# Altium project УПП.PrjPcb
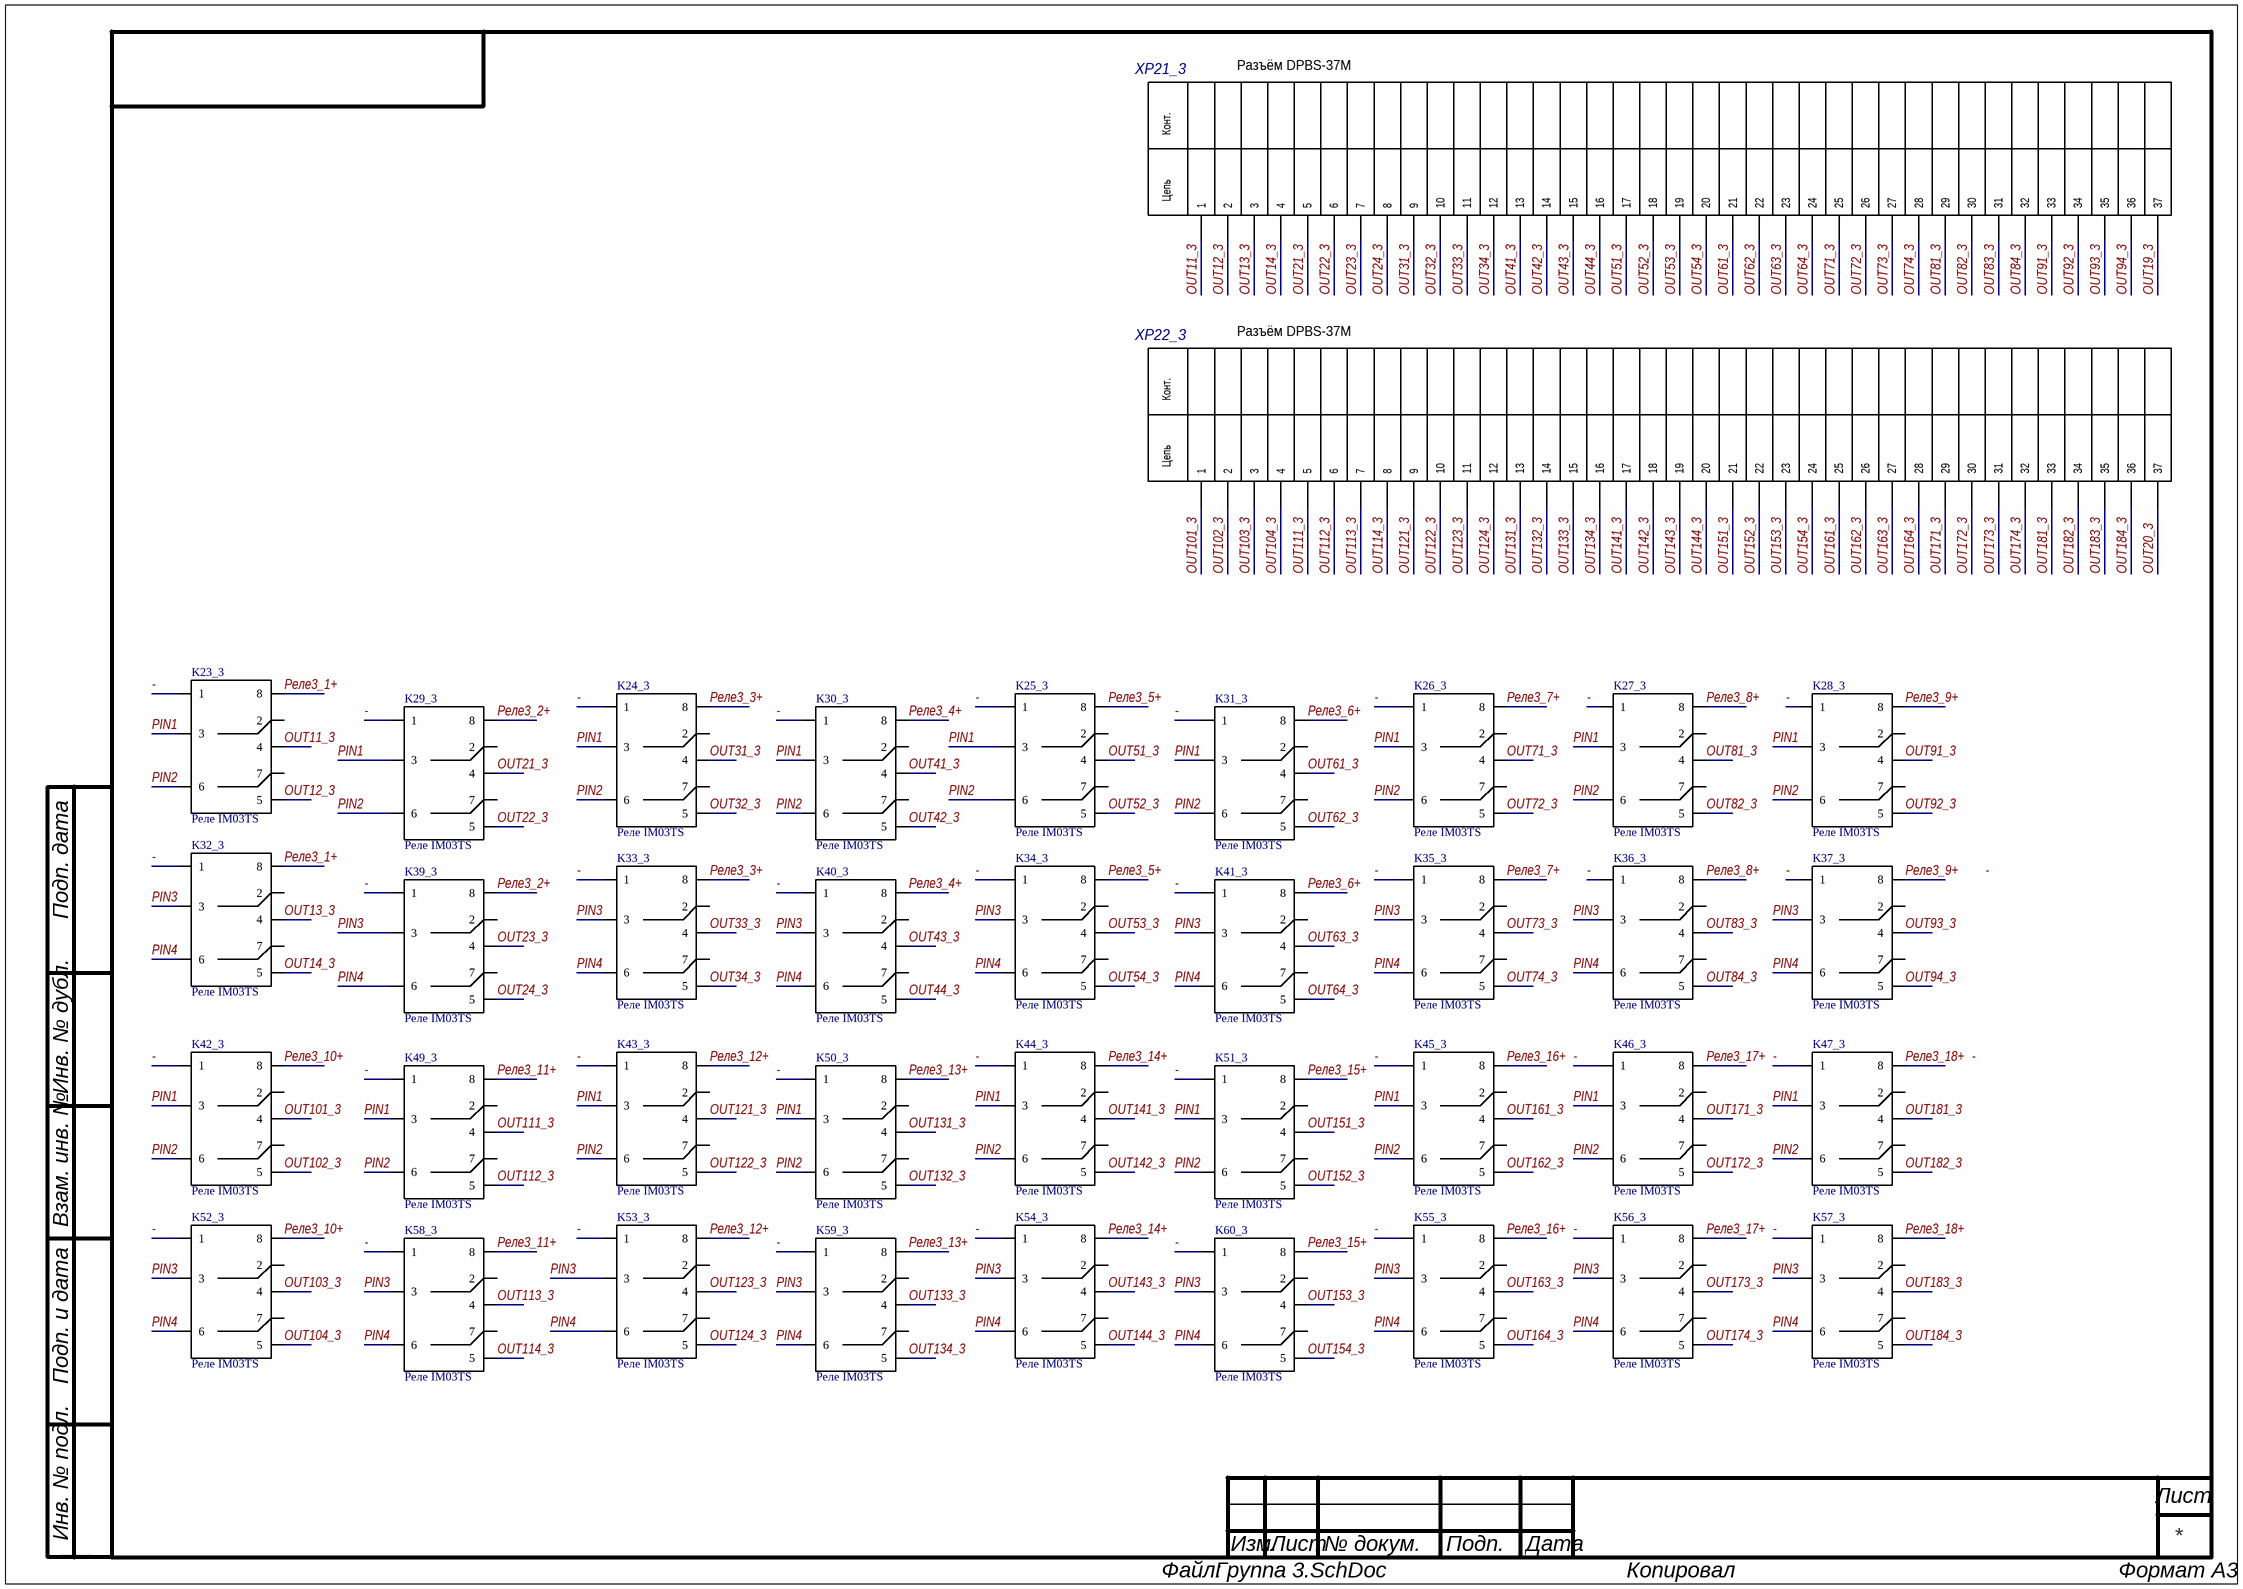
[diagram p0: Группа 3.SchDoc]
2 sheets, 76 parts. Net scope: global (net labels, ports and power ports of the same name join across sheets).
Board file: УПП.PcbDoc
Sheets:
  Группа 3.SchDoc
  Группа 4.SchDoc

## Sheet Группа 3.SchDoc
size 420 x 297 mm

### Parts
K23_3  Реле IM03TS  [IM03TS]
K24_3  Реле IM03TS  [IM03TS]
K25_3  Реле IM03TS  [IM03TS]
K26_3  Реле IM03TS  [IM03TS]
K27_3  Реле IM03TS  [IM03TS]
K28_3  Реле IM03TS  [IM03TS]
K29_3  Реле IM03TS  [IM03TS]
K30_3  Реле IM03TS  [IM03TS]
K31_3  Реле IM03TS  [IM03TS]
K32_3  Реле IM03TS  [IM03TS]
K33_3  Реле IM03TS  [IM03TS]
K34_3  Реле IM03TS  [IM03TS]
K35_3  Реле IM03TS  [IM03TS]
K36_3  Реле IM03TS  [IM03TS]
K37_3  Реле IM03TS  [IM03TS]
K39_3  Реле IM03TS  [IM03TS]
K40_3  Реле IM03TS  [IM03TS]
K41_3  Реле IM03TS  [IM03TS]
K42_3  Реле IM03TS  [IM03TS]
K43_3  Реле IM03TS  [IM03TS]
K44_3  Реле IM03TS  [IM03TS]
K45_3  Реле IM03TS  [IM03TS]
K46_3  Реле IM03TS  [IM03TS]
K47_3  Реле IM03TS  [IM03TS]
K49_3  Реле IM03TS  [IM03TS]
K50_3  Реле IM03TS  [IM03TS]
K51_3  Реле IM03TS  [IM03TS]
K52_3  Реле IM03TS  [IM03TS]
K53_3  Реле IM03TS  [IM03TS]
K54_3  Реле IM03TS  [IM03TS]
K55_3  Реле IM03TS  [IM03TS]
K56_3  Реле IM03TS  [IM03TS]
K57_3  Реле IM03TS  [IM03TS]
K58_3  Реле IM03TS  [IM03TS]
K59_3  Реле IM03TS  [IM03TS]
K60_3  Реле IM03TS  [IM03TS]
XP21_3  Разъём DPBS-37M  [DPBS-37M]
XP22_3  Разъём DPBS-37M  [DPBS-37M]

### Nets
-: K23_3.1 K24_3.1 K25_3.1 K26_3.1 K27_3.1 K28_3.1 K29_3.1 K30_3.1 K31_3.1 K32_3.1 K33_3.1 K34_3.1 K35_3.1 K36_3.1 K37_3.1 K39_3.1 K40_3.1 K41_3.1 K42_3.1 K43_3.1 K44_3.1 K45_3.1 K46_3.1 K47_3.1 K49_3.1 K50_3.1 K51_3.1 K52_3.1 K53_3.1 K54_3.1 K55_3.1 K56_3.1 K57_3.1 K58_3.1 K59_3.1 K60_3.1
OUT11_3: K23_3.4 XP21_3.1
OUT12_3: K23_3.5 XP21_3.2
OUT13_3: K32_3.4 XP21_3.3
OUT14_3: K32_3.5 XP21_3.4
OUT19_3: XP21_3.37
OUT20_3: XP22_3.37
OUT21_3: K29_3.4 XP21_3.5
OUT22_3: K29_3.5 XP21_3.6
OUT23_3: K39_3.4 XP21_3.7
OUT24_3: K39_3.5 XP21_3.8
OUT31_3: K24_3.4 XP21_3.9
OUT32_3: K24_3.5 XP21_3.10
OUT33_3: K33_3.4 XP21_3.11
OUT34_3: K33_3.5 XP21_3.12
OUT41_3: K30_3.4 XP21_3.13
OUT42_3: K30_3.5 XP21_3.14
OUT43_3: K40_3.4 XP21_3.15
OUT44_3: K40_3.5 XP21_3.16
OUT51_3: K25_3.4 XP21_3.17
OUT52_3: K25_3.5 XP21_3.18
OUT53_3: K34_3.4 XP21_3.19
OUT54_3: K34_3.5 XP21_3.20
OUT61_3: K31_3.4 XP21_3.21
OUT62_3: K31_3.5 XP21_3.22
OUT63_3: K41_3.4 XP21_3.23
OUT64_3: K41_3.5 XP21_3.24
OUT71_3: K26_3.4 XP21_3.25
OUT72_3: K26_3.5 XP21_3.26
OUT73_3: K35_3.4 XP21_3.27
OUT74_3: K35_3.5 XP21_3.28
OUT81_3: K27_3.4 XP21_3.29
OUT82_3: K27_3.5 XP21_3.30
OUT83_3: K36_3.4 XP21_3.31
OUT84_3: K36_3.5 XP21_3.32
OUT91_3: K28_3.4 XP21_3.33
OUT92_3: K28_3.5 XP21_3.34
OUT93_3: K37_3.4 XP21_3.35
OUT94_3: K37_3.5 XP21_3.36
OUT101_3: K42_3.4 XP22_3.1
OUT102_3: K42_3.5 XP22_3.2
OUT103_3: K52_3.4 XP22_3.3
OUT104_3: K52_3.5 XP22_3.4
OUT111_3: K49_3.4 XP22_3.5
OUT112_3: K49_3.5 XP22_3.6
OUT113_3: K58_3.4 XP22_3.7
OUT114_3: K58_3.5 XP22_3.8
OUT121_3: K43_3.4 XP22_3.9
OUT122_3: K43_3.5 XP22_3.10
OUT123_3: K53_3.4 XP22_3.11
OUT124_3: K53_3.5 XP22_3.12
OUT131_3: K50_3.4 XP22_3.13
OUT132_3: K50_3.5 XP22_3.14
OUT133_3: K59_3.4 XP22_3.15
OUT134_3: K59_3.5 XP22_3.16
OUT141_3: K44_3.4 XP22_3.17
OUT142_3: K44_3.5 XP22_3.18
OUT143_3: K54_3.4 XP22_3.19
OUT144_3: K54_3.5 XP22_3.20
OUT151_3: K51_3.4 XP22_3.21
OUT152_3: K51_3.5 XP22_3.22
OUT153_3: K60_3.4 XP22_3.23
OUT154_3: K60_3.5 XP22_3.24
OUT161_3: K45_3.4 XP22_3.25
OUT162_3: K45_3.5 XP22_3.26
OUT163_3: K55_3.4 XP22_3.27
OUT164_3: K55_3.5 XP22_3.28
OUT171_3: K46_3.4 XP22_3.29
OUT172_3: K46_3.5 XP22_3.30
OUT173_3: K56_3.4 XP22_3.31
OUT174_3: K56_3.5 XP22_3.32
OUT181_3: K47_3.4 XP22_3.33
OUT182_3: K47_3.5 XP22_3.34
OUT183_3: K57_3.4 XP22_3.35
OUT184_3: K57_3.5 XP22_3.36
PIN1: K23_3.3 K24_3.3 K25_3.3 K26_3.3 K27_3.3 K28_3.3 K29_3.3 K30_3.3 K31_3.3 K42_3.3 K43_3.3 K44_3.3 K45_3.3 K46_3.3 K47_3.3 K49_3.3 K50_3.3 K51_3.3
PIN2: K23_3.6 K24_3.6 K25_3.6 K26_3.6 K27_3.6 K28_3.6 K29_3.6 K30_3.6 K31_3.6 K42_3.6 K43_3.6 K44_3.6 K45_3.6 K46_3.6 K47_3.6 K49_3.6 K50_3.6 K51_3.6
PIN3: K32_3.3 K33_3.3 K34_3.3 K35_3.3 K36_3.3 K37_3.3 K39_3.3 K40_3.3 K41_3.3 K52_3.3 K53_3.3 K54_3.3 K55_3.3 K56_3.3 K57_3.3 K58_3.3 K59_3.3 K60_3.3
PIN4: K32_3.6 K33_3.6 K34_3.6 K35_3.6 K36_3.6 K37_3.6 K39_3.6 K40_3.6 K41_3.6 K52_3.6 K53_3.6 K54_3.6 K55_3.6 K56_3.6 K57_3.6 K58_3.6 K59_3.6 K60_3.6
Реле3_1+: K23_3.8 K32_3.8
Реле3_2+: K29_3.8 K39_3.8
Реле3_3+: K24_3.8 K33_3.8
Реле3_4+: K30_3.8 K40_3.8
Реле3_5+: K25_3.8 K34_3.8
Реле3_6+: K31_3.8 K41_3.8
Реле3_7+: K26_3.8 K35_3.8
Реле3_8+: K27_3.8 K36_3.8
Реле3_9+: K28_3.8 K37_3.8
Реле3_10+: K42_3.8 K52_3.8
Реле3_11+: K49_3.8 K58_3.8
Реле3_12+: K43_3.8 K53_3.8
Реле3_13+: K50_3.8 K59_3.8
Реле3_14+: K44_3.8 K54_3.8
Реле3_15+: K51_3.8 K60_3.8
Реле3_16+: K45_3.8 K55_3.8
Реле3_17+: K46_3.8 K56_3.8
Реле3_18+: K47_3.8 K57_3.8

Not connected (* = marked no-connect by the designer): K23_3 2 7; K24_3 2 7; K25_3 2 7; K26_3 2 7; K27_3 2 7; K28_3 2 7; K29_3 2 7; K30_3 2 7; K31_3 2 7; K32_3 2 7; K33_3 2 7; K34_3 2 7; K35_3 2 7; K36_3 2 7; K37_3 2 7; K39_3 2 7; K40_3 2 7; K41_3 2 7; K42_3 2 7; K43_3 2 7; K44_3 2 7; K45_3 2 7; K46_3 2 7; K47_3 2 7; K49_3 2 7; K50_3 2 7; K51_3 2 7; K52_3 2 7; K53_3 2 7; K54_3 2 7; K55_3 2 7; K56_3 2 7; K57_3 2 7; K58_3 2 7; K59_3 2 7; K60_3 2 7

### Notes on the sheet
- Labels drawn without touching a wire or pin: -
- Подп. дата
- Инв. № дубл.
- Взам. инв. №
- Подп. и дата
- Инв. № подл.
- Изм.
- Лист
- № докум.
- Подп.
- Дата
- ALTIUM GOSTBOM2.0 KEV
- Файл:
- Копировал
- Формат А3
- (in symbol DPBS-37M) Конт.; Цепь

### Library data of the parts
K23_3 K24_3 K25_3 K26_3 K27_3 K28_3 K29_3 K30_3 K31_3 K32_3 K33_3 K34_3 K35_3 K36_3 K37_3 K39_3 K40_3 K41_3 K42_3 K43_3 K44_3 K45_3 K46_3 K47_3 K49_3 K50_3 K51_3 K52_3 K53_3 K54_3 K55_3 K56_3 K57_3 K58_3 K59_3 K60_3 = IM03TS: Реле
XP21_3 XP22_3 = DPBS-37M

## Sheet Группа 4.SchDoc
size 420 x 297 mm
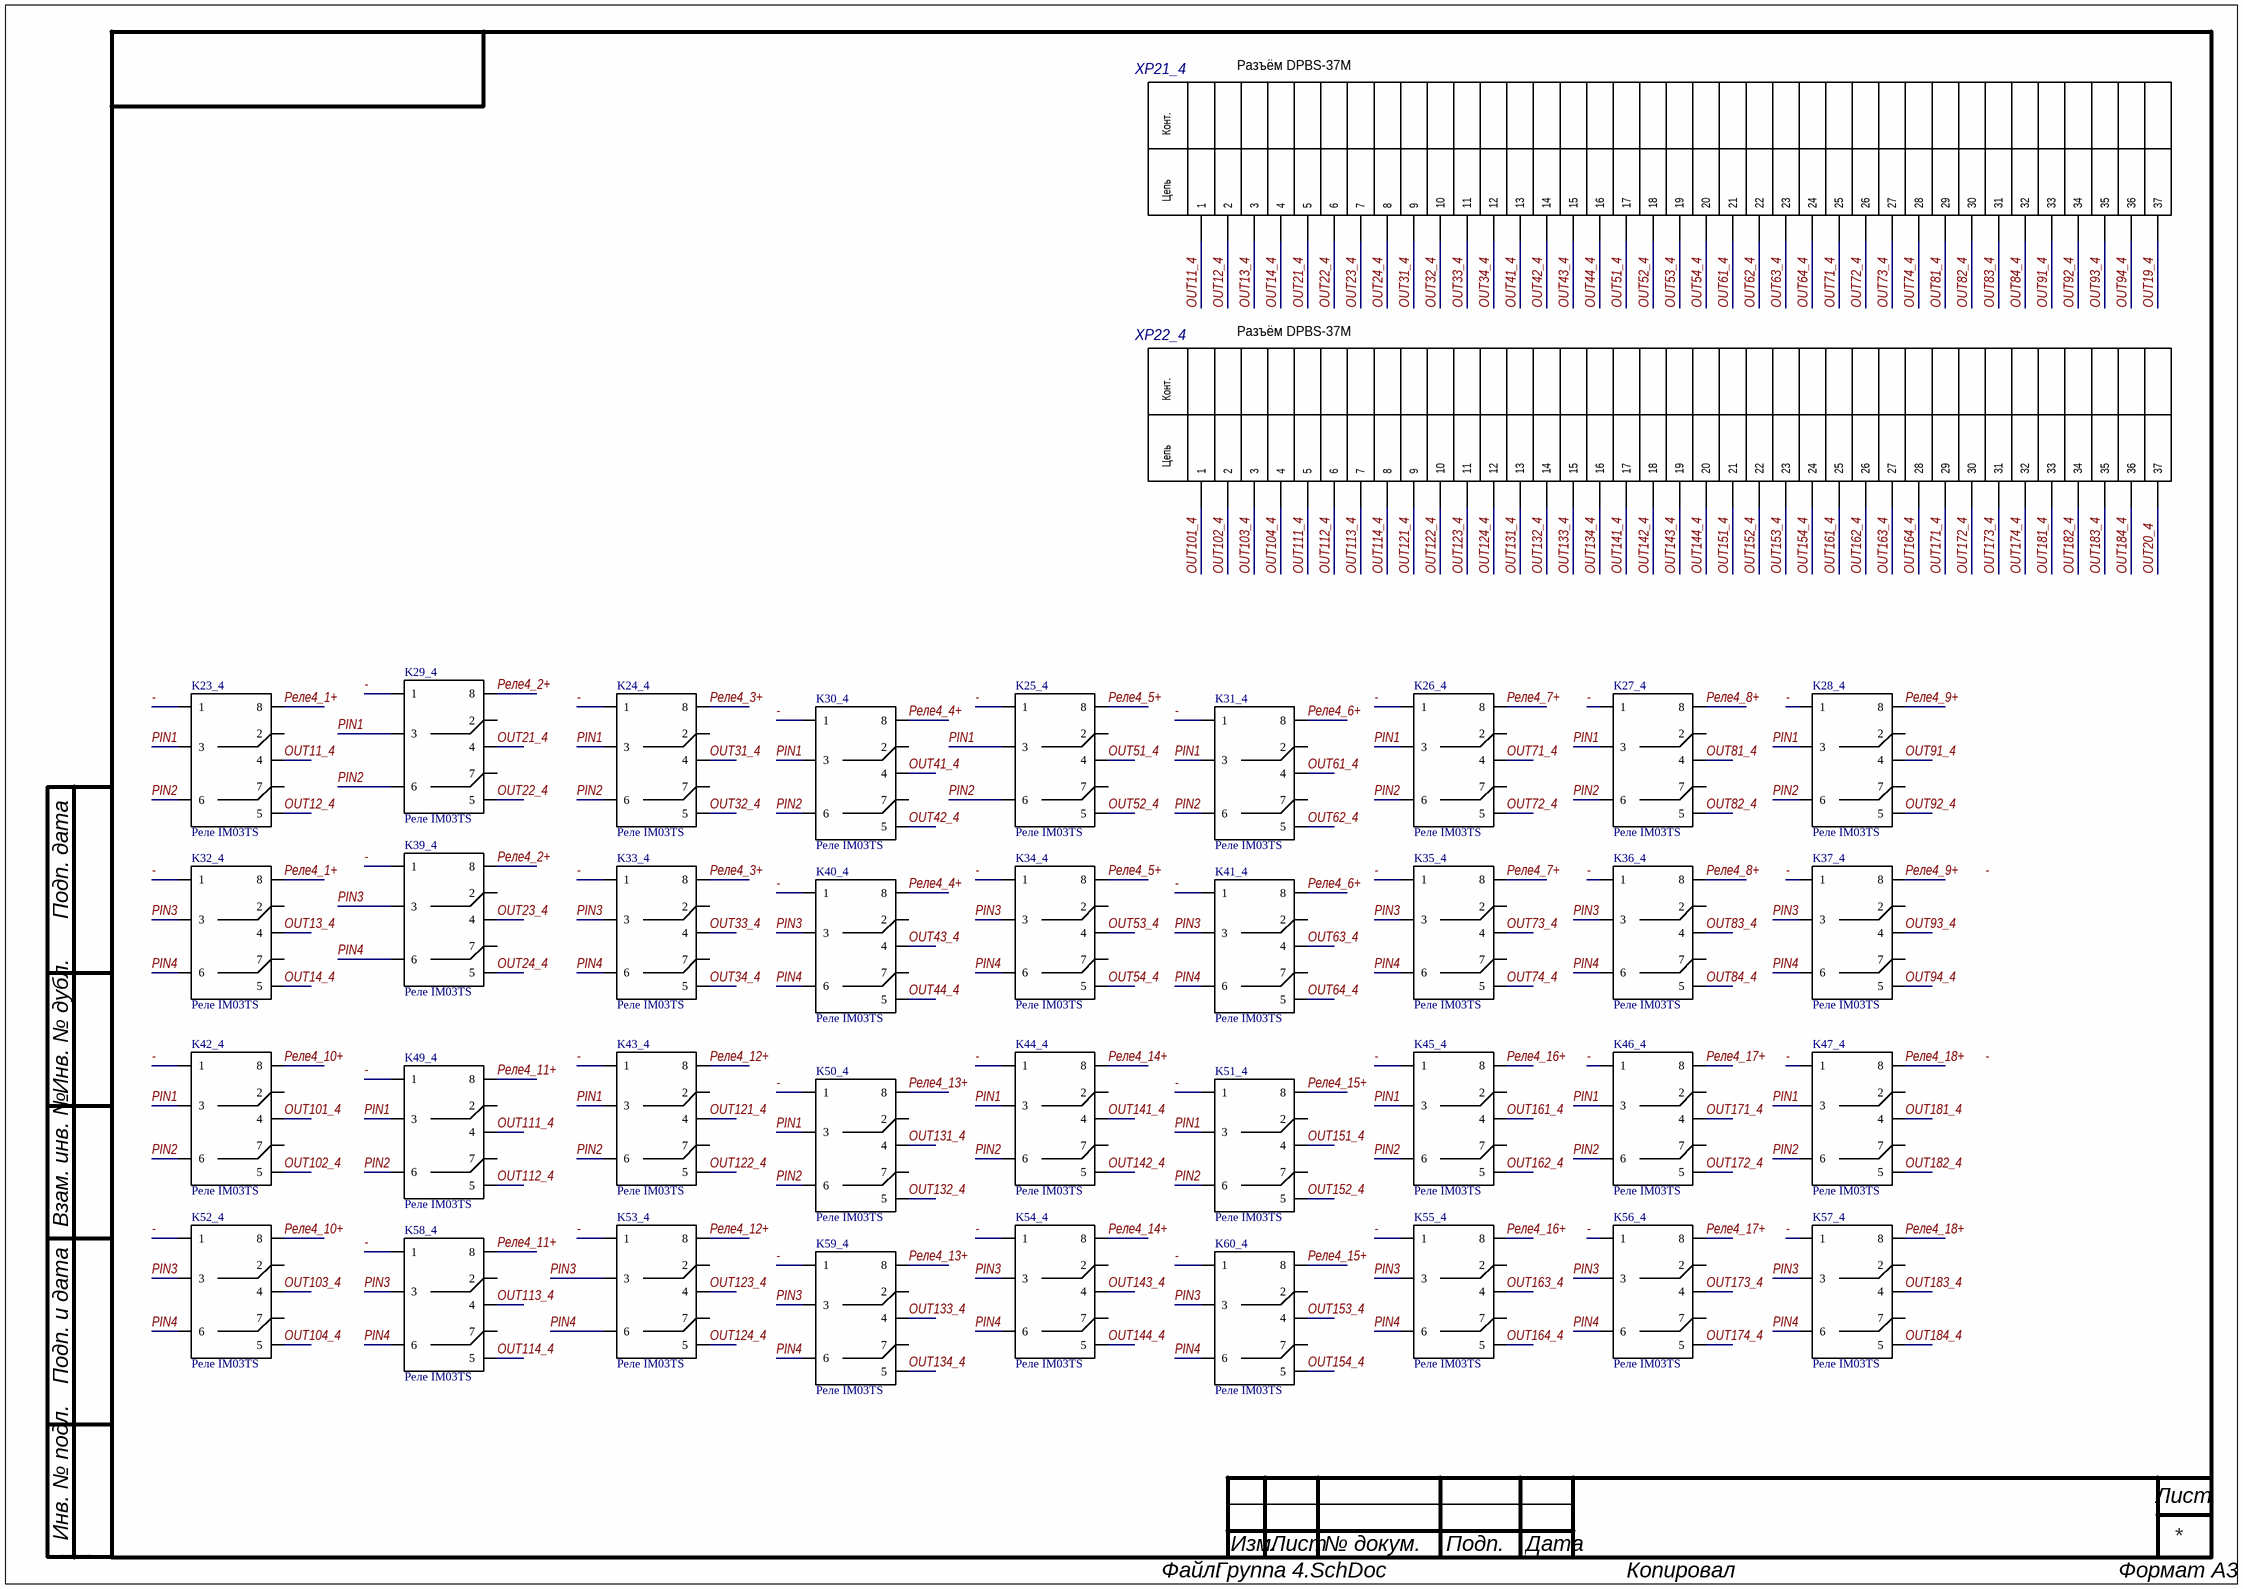
[diagram p1: Группа 4.SchDoc]

### Parts
K23_4  Реле IM03TS  [IM03TS]
K24_4  Реле IM03TS  [IM03TS]
K25_4  Реле IM03TS  [IM03TS]
K26_4  Реле IM03TS  [IM03TS]
K27_4  Реле IM03TS  [IM03TS]
K28_4  Реле IM03TS  [IM03TS]
K29_4  Реле IM03TS  [IM03TS]
K30_4  Реле IM03TS  [IM03TS]
K31_4  Реле IM03TS  [IM03TS]
K32_4  Реле IM03TS  [IM03TS]
K33_4  Реле IM03TS  [IM03TS]
K34_4  Реле IM03TS  [IM03TS]
K35_4  Реле IM03TS  [IM03TS]
K36_4  Реле IM03TS  [IM03TS]
K37_4  Реле IM03TS  [IM03TS]
K39_4  Реле IM03TS  [IM03TS]
K40_4  Реле IM03TS  [IM03TS]
K41_4  Реле IM03TS  [IM03TS]
K42_4  Реле IM03TS  [IM03TS]
K43_4  Реле IM03TS  [IM03TS]
K44_4  Реле IM03TS  [IM03TS]
K45_4  Реле IM03TS  [IM03TS]
K46_4  Реле IM03TS  [IM03TS]
K47_4  Реле IM03TS  [IM03TS]
K49_4  Реле IM03TS  [IM03TS]
K50_4  Реле IM03TS  [IM03TS]
K51_4  Реле IM03TS  [IM03TS]
K52_4  Реле IM03TS  [IM03TS]
K53_4  Реле IM03TS  [IM03TS]
K54_4  Реле IM03TS  [IM03TS]
K55_4  Реле IM03TS  [IM03TS]
K56_4  Реле IM03TS  [IM03TS]
K57_4  Реле IM03TS  [IM03TS]
K58_4  Реле IM03TS  [IM03TS]
K59_4  Реле IM03TS  [IM03TS]
K60_4  Реле IM03TS  [IM03TS]
XP21_4  Разъём DPBS-37M  [DPBS-37M]
XP22_4  Разъём DPBS-37M  [DPBS-37M]

### Nets
-: K23_4.1 K24_4.1 K25_4.1 K26_4.1 K27_4.1 K28_4.1 K29_4.1 K30_4.1 K31_4.1 K32_4.1 K33_4.1 K34_4.1 K35_4.1 K36_4.1 K37_4.1 K39_4.1 K40_4.1 K41_4.1 K42_4.1 K43_4.1 K44_4.1 K45_4.1 K46_4.1 K47_4.1 K49_4.1 K50_4.1 K51_4.1 K52_4.1 K53_4.1 K54_4.1 K55_4.1 K56_4.1 K57_4.1 K58_4.1 K59_4.1 K60_4.1
OUT11_4: K23_4.4 XP21_4.1
OUT12_4: K23_4.5 XP21_4.2
OUT13_4: K32_4.4 XP21_4.3
OUT14_4: K32_4.5 XP21_4.4
OUT19_4: XP21_4.37
OUT20_4: XP22_4.37
OUT21_4: K29_4.4 XP21_4.5
OUT22_4: K29_4.5 XP21_4.6
OUT23_4: K39_4.4 XP21_4.7
OUT24_4: K39_4.5 XP21_4.8
OUT31_4: K24_4.4 XP21_4.9
OUT32_4: K24_4.5 XP21_4.10
OUT33_4: K33_4.4 XP21_4.11
OUT34_4: K33_4.5 XP21_4.12
OUT41_4: K30_4.4 XP21_4.13
OUT42_4: K30_4.5 XP21_4.14
OUT43_4: K40_4.4 XP21_4.15
OUT44_4: K40_4.5 XP21_4.16
OUT51_4: K25_4.4 XP21_4.17
OUT52_4: K25_4.5 XP21_4.18
OUT53_4: K34_4.4 XP21_4.19
OUT54_4: K34_4.5 XP21_4.20
OUT61_4: K31_4.4 XP21_4.21
OUT62_4: K31_4.5 XP21_4.22
OUT63_4: K41_4.4 XP21_4.23
OUT64_4: K41_4.5 XP21_4.24
OUT71_4: K26_4.4 XP21_4.25
OUT72_4: K26_4.5 XP21_4.26
OUT73_4: K35_4.4 XP21_4.27
OUT74_4: K35_4.5 XP21_4.28
OUT81_4: K27_4.4 XP21_4.29
OUT82_4: K27_4.5 XP21_4.30
OUT83_4: K36_4.4 XP21_4.31
OUT84_4: K36_4.5 XP21_4.32
OUT91_4: K28_4.4 XP21_4.33
OUT92_4: K28_4.5 XP21_4.34
OUT93_4: K37_4.4 XP21_4.35
OUT94_4: K37_4.5 XP21_4.36
OUT101_4: K42_4.4 XP22_4.1
OUT102_4: K42_4.5 XP22_4.2
OUT103_4: K52_4.4 XP22_4.3
OUT104_4: K52_4.5 XP22_4.4
OUT111_4: K49_4.4 XP22_4.5
OUT112_4: K49_4.5 XP22_4.6
OUT113_4: K58_4.4 XP22_4.7
OUT114_4: K58_4.5 XP22_4.8
OUT121_4: K43_4.4 XP22_4.9
OUT122_4: K43_4.5 XP22_4.10
OUT123_4: K53_4.4 XP22_4.11
OUT124_4: K53_4.5 XP22_4.12
OUT131_4: K50_4.4 XP22_4.13
OUT132_4: K50_4.5 XP22_4.14
OUT133_4: K59_4.4 XP22_4.15
OUT134_4: K59_4.5 XP22_4.16
OUT141_4: K44_4.4 XP22_4.17
OUT142_4: K44_4.5 XP22_4.18
OUT143_4: K54_4.4 XP22_4.19
OUT144_4: K54_4.5 XP22_4.20
OUT151_4: K51_4.4 XP22_4.21
OUT152_4: K51_4.5 XP22_4.22
OUT153_4: K60_4.4 XP22_4.23
OUT154_4: K60_4.5 XP22_4.24
OUT161_4: K45_4.4 XP22_4.25
OUT162_4: K45_4.5 XP22_4.26
OUT163_4: K55_4.4 XP22_4.27
OUT164_4: K55_4.5 XP22_4.28
OUT171_4: K46_4.4 XP22_4.29
OUT172_4: K46_4.5 XP22_4.30
OUT173_4: K56_4.4 XP22_4.31
OUT174_4: K56_4.5 XP22_4.32
OUT181_4: K47_4.4 XP22_4.33
OUT182_4: K47_4.5 XP22_4.34
OUT183_4: K57_4.4 XP22_4.35
OUT184_4: K57_4.5 XP22_4.36
PIN1: K23_4.3 K24_4.3 K25_4.3 K26_4.3 K27_4.3 K28_4.3 K29_4.3 K30_4.3 K31_4.3 K42_4.3 K43_4.3 K44_4.3 K45_4.3 K46_4.3 K47_4.3 K49_4.3 K50_4.3 K51_4.3
PIN2: K23_4.6 K24_4.6 K25_4.6 K26_4.6 K27_4.6 K28_4.6 K29_4.6 K30_4.6 K31_4.6 K42_4.6 K43_4.6 K44_4.6 K45_4.6 K46_4.6 K47_4.6 K49_4.6 K50_4.6 K51_4.6
PIN3: K32_4.3 K33_4.3 K34_4.3 K35_4.3 K36_4.3 K37_4.3 K39_4.3 K40_4.3 K41_4.3 K52_4.3 K53_4.3 K54_4.3 K55_4.3 K56_4.3 K57_4.3 K58_4.3 K59_4.3 K60_4.3
PIN4: K32_4.6 K33_4.6 K34_4.6 K35_4.6 K36_4.6 K37_4.6 K39_4.6 K40_4.6 K41_4.6 K52_4.6 K53_4.6 K54_4.6 K55_4.6 K56_4.6 K57_4.6 K58_4.6 K59_4.6 K60_4.6
Реле4_1+: K23_4.8 K32_4.8
Реле4_2+: K29_4.8 K39_4.8
Реле4_3+: K24_4.8 K33_4.8
Реле4_4+: K30_4.8 K40_4.8
Реле4_5+: K25_4.8 K34_4.8
Реле4_6+: K31_4.8 K41_4.8
Реле4_7+: K26_4.8 K35_4.8
Реле4_8+: K27_4.8 K36_4.8
Реле4_9+: K28_4.8 K37_4.8
Реле4_10+: K42_4.8 K52_4.8
Реле4_11+: K49_4.8 K58_4.8
Реле4_12+: K43_4.8 K53_4.8
Реле4_13+: K50_4.8 K59_4.8
Реле4_14+: K44_4.8 K54_4.8
Реле4_15+: K51_4.8 K60_4.8
Реле4_16+: K45_4.8 K55_4.8
Реле4_17+: K46_4.8 K56_4.8
Реле4_18+: K47_4.8 K57_4.8

Not connected (* = marked no-connect by the designer): K23_4 2 7; K24_4 2 7; K25_4 2 7; K26_4 2 7; K27_4 2 7; K28_4 2 7; K29_4 2 7; K30_4 2 7; K31_4 2 7; K32_4 2 7; K33_4 2 7; K34_4 2 7; K35_4 2 7; K36_4 2 7; K37_4 2 7; K39_4 2 7; K40_4 2 7; K41_4 2 7; K42_4 2 7; K43_4 2 7; K44_4 2 7; K45_4 2 7; K46_4 2 7; K47_4 2 7; K49_4 2 7; K50_4 2 7; K51_4 2 7; K52_4 2 7; K53_4 2 7; K54_4 2 7; K55_4 2 7; K56_4 2 7; K57_4 2 7; K58_4 2 7; K59_4 2 7; K60_4 2 7

### Notes on the sheet
- Labels drawn without touching a wire or pin: -
- Подп. дата
- Инв. № дубл.
- Взам. инв. №
- Подп. и дата
- Инв. № подл.
- Изм.
- Лист
- № докум.
- Подп.
- Дата
- ALTIUM GOSTBOM2.0 KEV
- Файл:
- Копировал
- Формат А3
- (in symbol DPBS-37M) Конт.; Цепь

### Library data of the parts
K23_4 K24_4 K25_4 K26_4 K27_4 K28_4 K29_4 K30_4 K31_4 K32_4 K33_4 K34_4 K35_4 K36_4 K37_4 K39_4 K40_4 K41_4 K42_4 K43_4 K44_4 K45_4 K46_4 K47_4 K49_4 K50_4 K51_4 K52_4 K53_4 K54_4 K55_4 K56_4 K57_4 K58_4 K59_4 K60_4 = IM03TS: Реле
XP21_4 XP22_4 = DPBS-37M

## Nets that join several sheets
-: Группа 3 (36 pins), Группа 4 (36 pins)
PIN1: Группа 3 (18 pins), Группа 4 (18 pins)
PIN2: Группа 3 (18 pins), Группа 4 (18 pins)
PIN3: Группа 3 (18 pins), Группа 4 (18 pins)
PIN4: Группа 3 (18 pins), Группа 4 (18 pins)